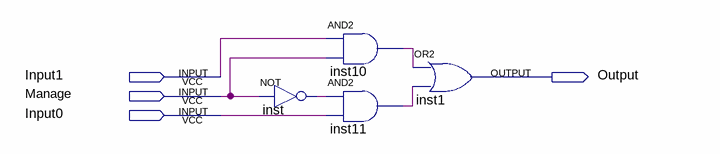
[diagram p0: schematic sheet]
// Quartus schematic Mul2.bdf as structural Verilog: 4 symbols, 4 pins
module Mul2 (
  input  Input1,
  input  Manage,
  input  Input0,
  output Output
);

  wire inst10_out, inst11_out, inst_out;

  not inst (inst_out, Manage);
  and inst10 (inst10_out, Input1, Manage);
  and inst11 (inst11_out, inst_out, Input0);
  or inst1 (Output, inst10_out, inst11_out);
endmodule
